# Altium schematic sheet PCIE_CON.SchDoc: PCIe connector
size 297 x 209 mm; CheckedBy: MC, TW, EB; CompanyName: CERN; DrawnBy: Greg Kasprowicz; Organization: CERN; Address1: European Organization for Nuclear Research; Address2: CH-1211 Geneve 23 - Switzerland; DocumentNumber: 11; Revision: -; SheetNumber: 11; SheetTotal: 17; EDA_Number: EDA-02189-V4-0; Projet: Simple PCIe Carrier Board; ModifiedBy: TW, MC; CreateDate: 10/07/2010; CheckedDate: 11/05/2011; DivGrp: BE-CO; Designer: GK, MC, TW, EB, PAS; ModifiedDate: -
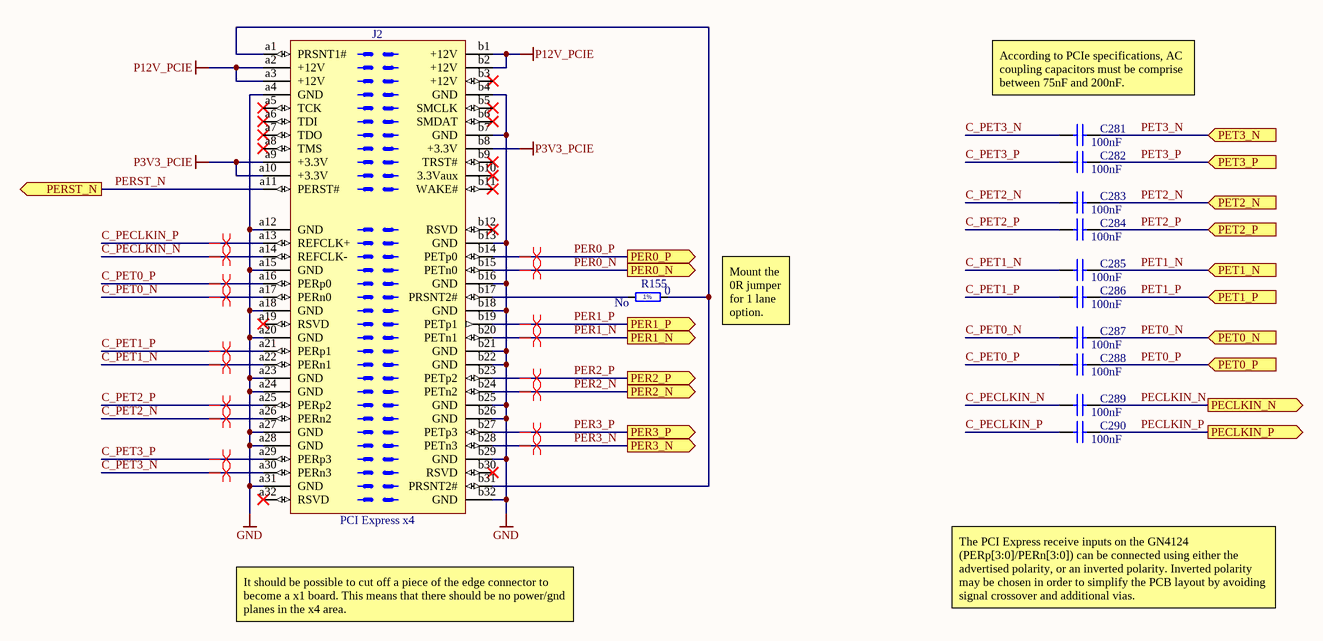
[diagram p0: PCIE_CON.SchDoc]

## Parts
C281  100nF  [CAPC1005X55N]
C282  100nF  [CAPC1005X55N]
C283  100nF  [CAPC1005X55N]
C284  100nF  [CAPC1005X55N]
C285  100nF  [CAPC1005X55N]
C286  100nF  [CAPC1005X55N]
C287  100nF  [CAPC1005X55N]
C288  100nF  [CAPC1005X55N]
C289  100nF  [CAPC1005X55N]
C290  100nF  [CAPC1005X55N]
J2  PCI Express x4  [PCI Express x4]
R155  0  Mounted: No  [RESC1608X55N]

## Ports
PECLKIN_N (out), PECLKIN_P (out), PER0_N (out), PER0_P (out), PER1_N (out), PER1_P (out), PER2_N (out), PER2_P (out), PER3_N (out), PER3_P (out), PERST_N (out), PET0_N (in), PET0_P (in), PET1_N (in), PET1_P (in), PET2_N (in), PET2_P (in), PET3_N (in), PET3_P (in)

## Nets
GND: J2.a4(GND) J2.a12(GND) J2.a15(GND) J2.a18(GND) J2.a20(GND) J2.a23(GND) J2.a24(GND) J2.a27(GND) J2.a28(GND) J2.a31(GND) J2.b4(GND) J2.b7(GND) J2.b13(GND) J2.b16(GND) J2.b18(GND) J2.b21(GND) J2.b22(GND) J2.b25(GND) J2.b26(GND) J2.b29(GND) J2.b32(GND)
P3V3_PCIE: J2.a9(+3.3V) J2.a10(+3.3V) J2.b8(+3.3V)
P12V_PCIE: J2.a2(+12V) J2.a3(+12V) J2.b1(+12V) J2.b2(+12V)
C_PECLKIN_N: C289.1 J2.a14(REFCLK-)
C_PECLKIN_P: C290.1 J2.a13(REFCLK+)
C_PET0_N: C287.1 J2.a17(PERn0)
C_PET0_P: C288.1 J2.a16(PERp0)
C_PET1_N: C285.1 J2.a22(PERn1)
C_PET1_P: C286.1 J2.a21(PERp1)
C_PET2_N: C283.1 J2.a26(PERn2)
C_PET2_P: C284.1 J2.a25(PERp2)
C_PET3_N: C281.1 J2.a30(PERn3)
C_PET3_P: C282.1 J2.a29(PERp3)
PECLKIN_N: C289.2 ; port PECLKIN_N
PECLKIN_P: C290.2 ; port PECLKIN_P
PER0_N: J2.b15(PETn0) ; port PER0_N
PER0_P: J2.b14(PETp0) ; port PER0_P
PER1_N: J2.b20(PETn1) ; port PER1_N
PER1_P: J2.b19(PETp1) ; port PER1_P
PER2_N: J2.b24(PETn2) ; port PER2_N
PER2_P: J2.b23(PETp2) ; port PER2_P
PER3_N: J2.b28(PETn3) ; port PER3_N
PER3_P: J2.b27(PETp3) ; port PER3_P
PERST_N: J2.a11(PERST#) ; port PERST_N
PET0_N: C287.2 ; port PET0_N
PET0_P: C288.2 ; port PET0_P
PET1_N: C285.2 ; port PET1_N
PET1_P: C286.2 ; port PET1_P
PET2_N: C283.2 ; port PET2_N
PET2_P: C284.2 ; port PET2_P
PET3_N: C281.2 ; port PET3_N
PET3_P: C282.2 ; port PET3_P
NetJ2_a1: J2.a1(PRSNT1#) J2.b31(PRSNT2#) R155.2
NetJ2_b17: J2.b17(PRSNT2#) R155.1

Not connected (* = marked no-connect by the designer): J2 a5(TCK)* a6(TDI)* a7(TDO)* a8(TMS)* a19(RSVD)* a32(RSVD)* b3(+12V)* b5(SMCLK)* b6(SMDAT)* b9(TRST#)* b10(3.3Vaux)* b11(WAKE#)* b12(RSVD)* b30(RSVD)*

## Layout directives
differential pair: C_PECLKIN_N, C_PECLKIN_P, C_PET0_N, C_PET0_P, C_PET1_N, C_PET1_P, C_PET2_N, C_PET2_P, C_PET3_N, C_PET3_P, PER0_N, PER0_P, PER1_N, PER1_P, PER2_N, PER2_P, PER3_N, PER3_P

## Notes on the sheet
- (near C281) According to PCIe specifications, AC coupling capacitors must be comprise between 75nF and 200nF.
- Mount the 0R jumper for 1 lane option.
- It should be possible to cut off a piece of the edge connector to become a x1 board. This means that there should be no power/gnd planes in the x4 area.
- The PCI Express receive inputs on the GN4124 (PERp[3:0]/PERn[3:0]) can be connected using either the advertised polarity, or an inverted polarity. Inverted polarity may be chosen in order to simplify the PCB layout by avoiding signal crossover and additional vias.
- Project/Equipment
- Document
- Designer
- Drawn by
- Check.by
- File
- Last Mod.
- Print Date
- Sheet
- Size
- A4
- of
- Rev
- (in symbol R0603_0R_JUMPER) 1%

## Library data of the parts
C281-C290 = CC0402_100NF_16V_10%_X7R: Non-polarised capacitor; Part Description: SMD Multilayer Chip Ceramic Capacitor; Manufacturer: GENERIC; Manufacturer1 Part Number: 223878715649; Voltage: 16V; TC: X7R; Tolerance: ±10%; Table: Capacitors SMD; Part Number: CC0402_100NF_16V_10%_X7R; Component Kind: Standard; Component Type: Standard; Pin Count: 2; Value: 100nF; Status: Not Recommended; Manufacturer Part Number: CC0402_100NF_16V_10%_X7R; Case: 0402; Mounted: Yes; Socket: No; SMD: Yes; Manufacturer1 Example: PHYCOMP; Manufacturer1 ComponentHeight: 0.55mm; HelpURL: \\cern.ch\dfs\Applications\Altium\Datasheets\CC0402_X7R_PHYCOMP.pdf; Author: CERN DEM JLC; CreateDate: 12/3/2007; LatestRevisionDate: 12/3/2007
J2 = PCI Express x4: 64 contacts Board Eddge PCI Express x4 Connector; Manufacturer: PCI-SIG; Mounted: No; Table: Miscellaneous; Part Number: PCI Express x4; Component Kind: Standard (No BOM); Component Type: Standard (No BOM); Pin Count: 64; Family: PCI Express x4; Socket: No; SMD: No; Status: None; Part Description: 64 contacts Board Eddge PCI Express x4 Connector; ComponentHeight: 0mm; HelpURL: \\cern.ch\dfs\Applications\Altium\Datasheets\PCI Express x4.pdf; Author: CERN DEM JLC; CreateDate: 12/3/2009; LatestRevisionDate: 12/3/2009
R155 = R0603_0R_JUMPER: Resistor - 1%; Part Description: 1A (0.05R Max DC Resistance) Zero Ohm Jumper; Manufacturer: GENERIC; Manufacturer1 Part Number: NRC06Z0; Table: Resistors SMD; Part Number: R0603_0R_JUMPER; Component Kind: Standard; Component Type: Standard; Pin Count: 2; Value: 0; Status: Preferred; Manufacturer Part Number: R0603_0R_JUMPER; Case: 0603; Socket: No; SMD: Yes; Manufacturer1 Example: NIC COMPONENT; Manufacturer1 ComponentHeight: 0.55mm; HelpURL: \\cern.ch\dfs\Applications\Altium\Datasheets\R0603_NIC_NRC.pdf; Author: CERN DEM JLC; CreateDate: 12/3/2007; LatestRevisionDate: 3/13/2008